# EAGLE schematic galvanika-board-2.0 (EAGLE 9.4.2)
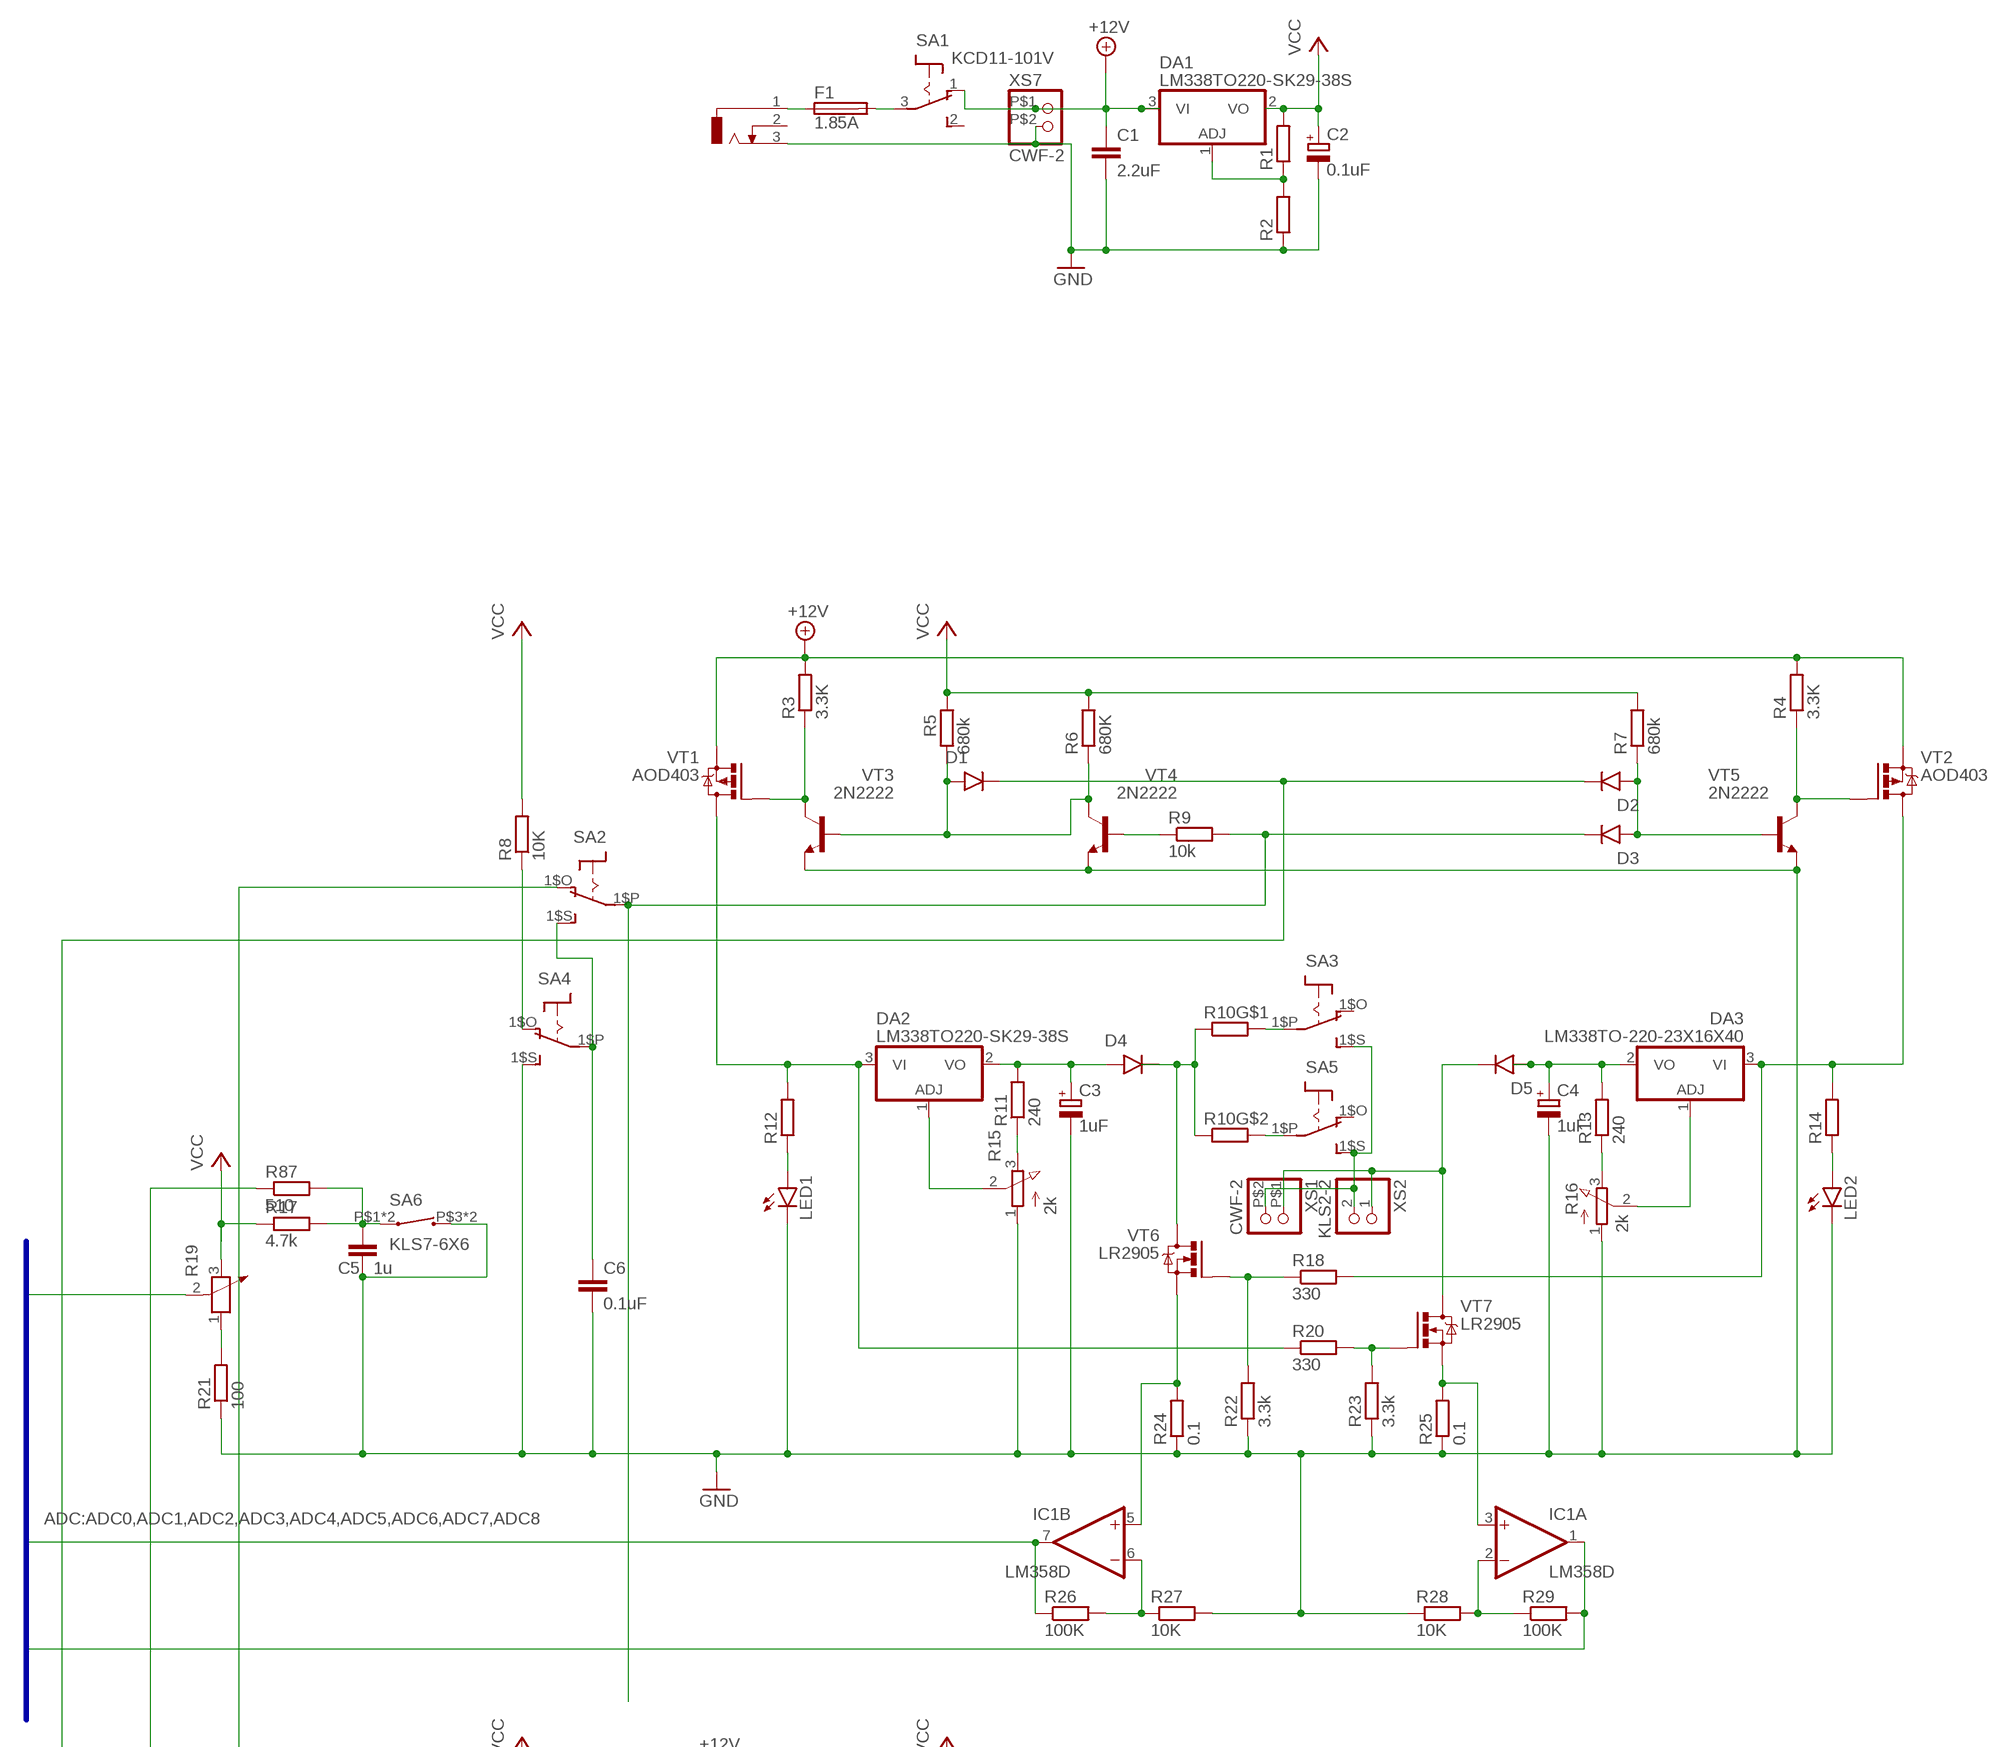
[diagram p0: schematic, sheet 1, part 1 of 2]
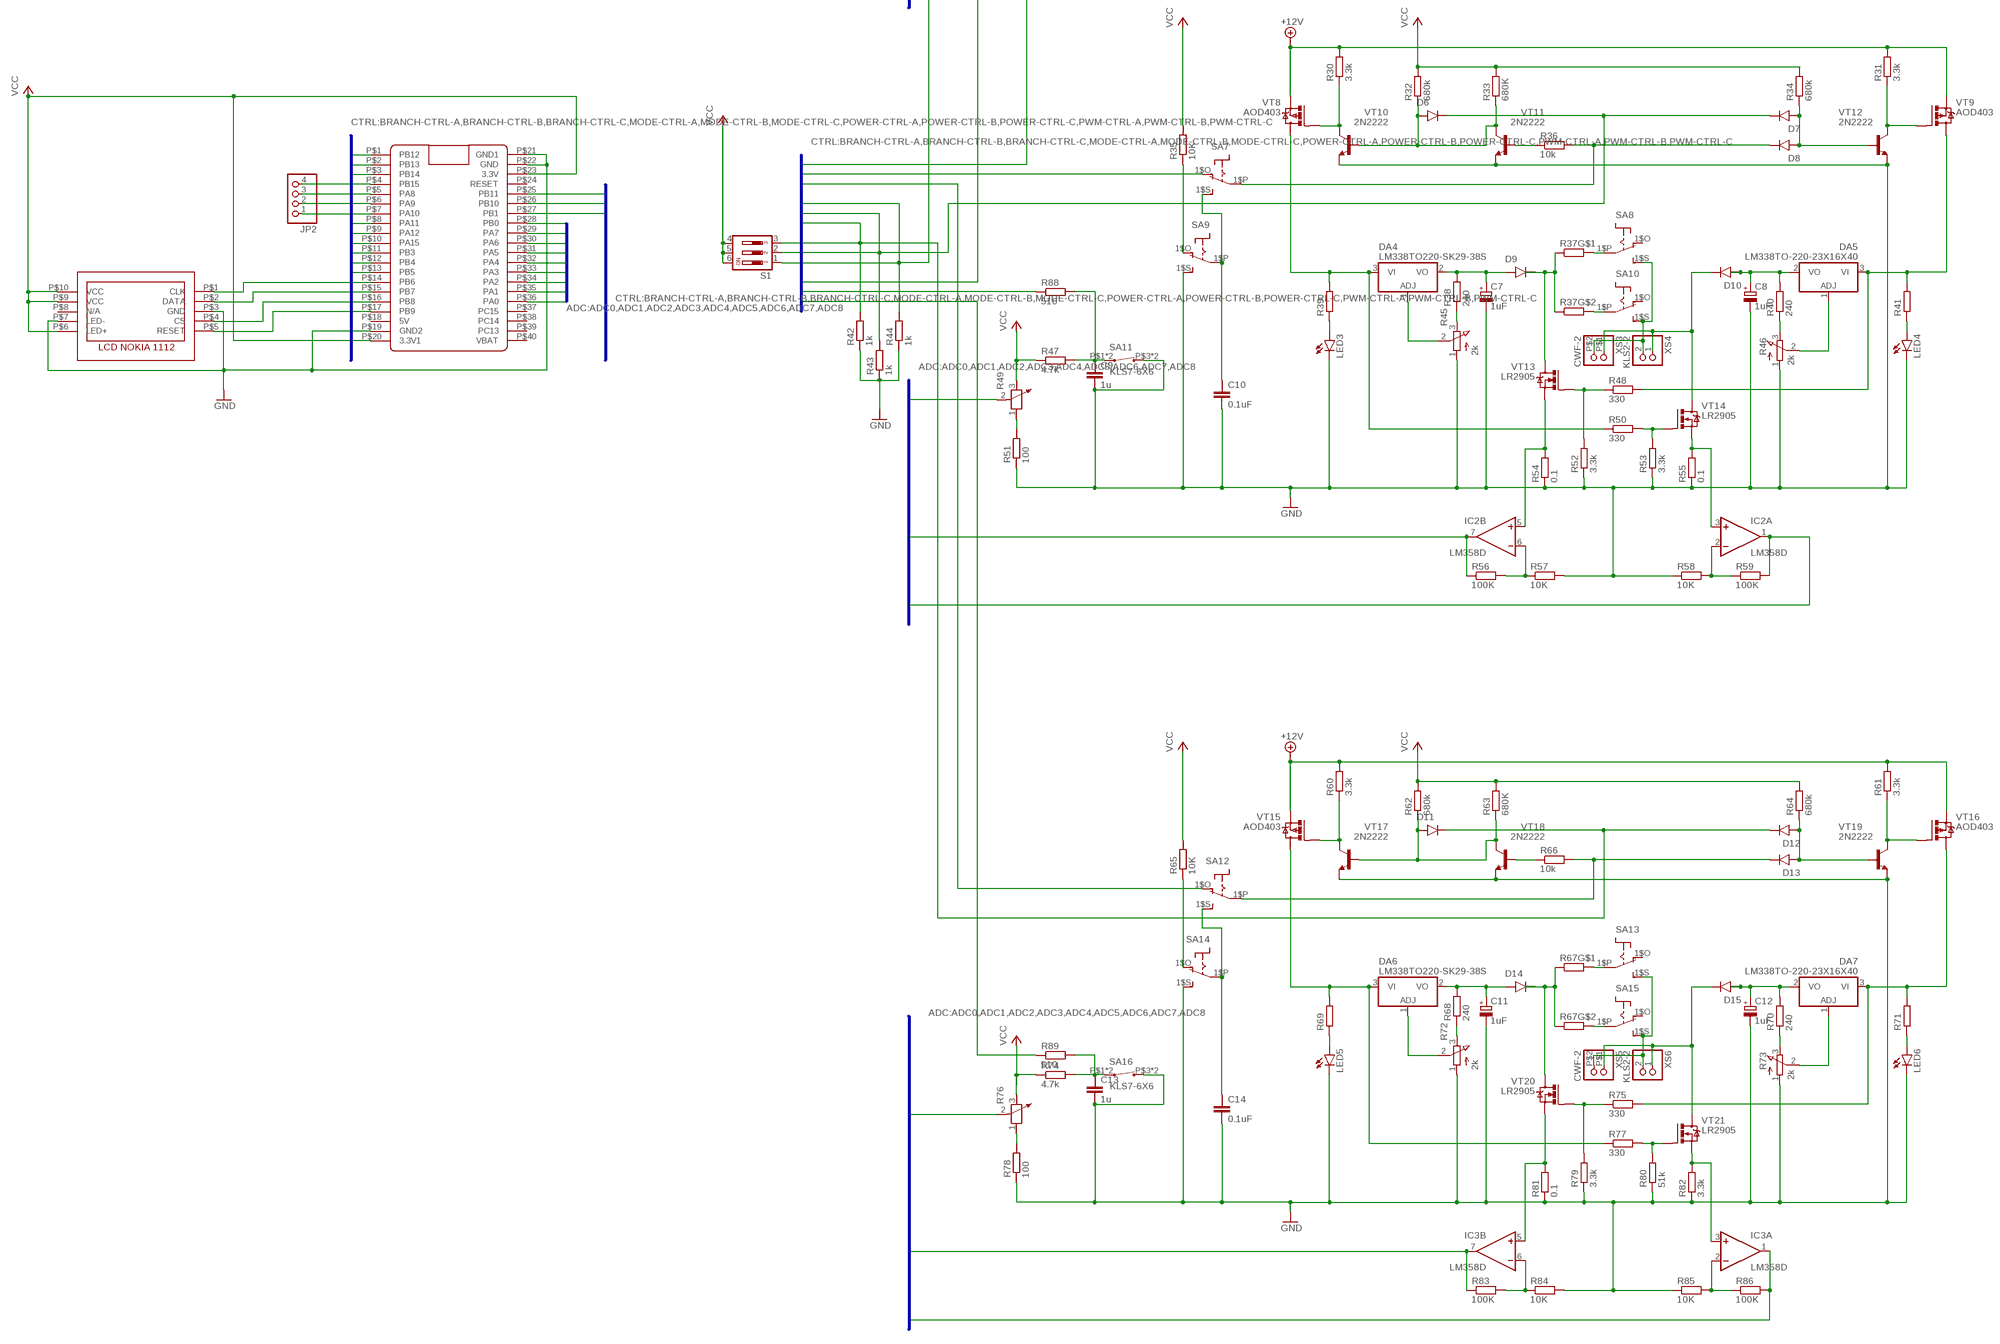
[diagram p1: schematic, sheet 1, part 2 of 2]

## Parts
C1  2.2uF  C-EU025-025X050  [C025-025X050]
C2  0.1uF  CPOL-EUE2.5-5  [E2,5-5]
C3  1uF  CPOL-EUE5-4  [E5-4]
C4  1uF  CPOL-EUE5-4  [E5-4]
C5  1u  C-EUC1206  [C1206]
C6  0.1uF  C-EUC1206  [C1206]
C7  1uF  CPOL-EUE5-4  [E5-4]
C8  1uF  CPOL-EUE5-4  [E5-4]
C9  1u  C-EUC1206  [C1206]
C10  0.1uF  C-EUC1206  [C1206]
C11  1uF  CPOL-EUE5-4  [E5-4]
C12  1uF  CPOL-EUE5-4  [E5-4]
C13  1u  C-EUC1206  [C1206]
C14  0.1uF  C-EUC1206  [C1206]
D1  1N4001  [DO41-10]
D2  1N4001  [DO41-10]
D3  1N4001  [DO41-10]
D4  1N4001  [DO41-10]
D5  1N4001  [DO41-10]
D6  1N4001  [DO41-10]
D7  1N4001  [DO41-10]
D8  1N4001  [DO41-10]
D9  1N4001  [DO41-10]
D10  1N4001  [DO41-10]
D11  1N4001  [DO41-10]
D12  1N4001  [DO41-10]
D13  1N4001  [DO41-10]
D14  1N4001  [DO41-10]
D15  1N4001  [DO41-10]
DA1  LM338TO220-SK29-38S  [TO220-SK29-38S]
DA2  LM338TO220-SK29-38S  [TO220-SK29-38S]
DA3  LM338TO-220-23X16X40  [TO220-23X16X40]
DA4  LM338TO220-SK29-38S  [TO220-SK29-38S]
DA5  LM338TO-220-23X16X40  [TO220-23X16X40]
DA6  LM338TO220-SK29-38S  [TO220-SK29-38S]
DA7  LM338TO-220-23X16X40  [TO220-23X16X40]
DD1  BLUE_PILL  [BLUE_PILL]
F1  1.85A  MF-R  [MF-R]
HG1  WD-G0906WY-BOARD  [WD-G0906WY-BOARD]
IC1  LM358D  [SO08]
IC2  LM358D  [SO08]
IC3  LM358D  [SO08]
J1  DCJ0303  [DCJ0303]
JP2  PINHD-1X4  [1X04]
LED1  LED3MM  [LED3MM]
LED2  LED3MM  [LED3MM]
LED3  LED3MM  [LED3MM]
LED4  LED3MM  [LED3MM]
LED5  LED3MM  [LED3MM]
LED6  LED3MM  [LED3MM]
R1  R-EU_0207/10  [0207/10]
R2  R-EU_0207/10  [0207/10]
R3  3.3K  R-EU_0207/10  [0207/10]
R4  3.3K  R-EU_0207/10  [0207/10]
R5  680k  R-EU_0207/10  [0207/10]
R6  680K  R-EU_0207/10  [0207/10]
R7  680k  R-EU_0207/10  [0207/10]
R8  10K  R-EU_0207/10  [0207/10]
R9  10k  R-EU_0207/10  [0207/10]
R10  SQP-5W-2  [SQP-5W-2]
R11  240  R-EU_0207/10  [0207/10]
R12  R-EU_0207/10  [0207/10]
R13  240  R-EU_0207/10  [0207/10]
R14  R-EU_0207/10  [0207/10]
R15  2k  3RP/1610N  [3RP/1610N]
R16  2k  3RP/1610N  [3RP/1610N]
R17  4.7k  R-EU_R1206  [R1206]
R18  330  R-EU_0207/10  [0207/10]
R19  R0904N  [R0904N]
R20  330  R-EU_0207/10  [0207/10]
R21  100  R-EU_R1206  [R1206]
R22  3.3k  R-EU_0207/10  [0207/10]
R23  3.3k  R-EU_0207/10  [0207/10]
R24  0.1  R-EU_0411/12  [0411/12]
R25  0.1  R-EU_0411/12  [0411/12]
R26  100K  R-EU_R1206  [R1206]
R27  10K  R-EU_R1206  [R1206]
R28  10K  R-EU_R1206  [R1206]
R29  100K  R-EU_R1206  [R1206]
R30  3.3k  R-EU_0207/10  [0207/10]
R31  3.3k  R-EU_0207/10  [0207/10]
R32  680k  R-EU_0207/10  [0207/10]
R33  680K  R-EU_0207/10  [0207/10]
R34  680k  R-EU_0207/10  [0207/10]
R35  10K  R-EU_0207/10  [0207/10]
R36  10k  R-EU_0207/10  [0207/10]
R37  SQP-5W-2  [SQP-5W-2]
R38  240  R-EU_0207/10  [0207/10]
R39  R-EU_0207/10  [0207/10]
R40  240  R-EU_0207/10  [0207/10]
R41  R-EU_0207/10  [0207/10]
R42  1k  R-EU_R1206  [R1206]
R43  1k  R-EU_R1206  [R1206]
R44  1k  R-EU_R1206  [R1206]
R45  2k  3RP/1610N  [3RP/1610N]
R46  2k  3RP/1610N  [3RP/1610N]
R47  4.7k  R-EU_R1206  [R1206]
R48  330  R-EU_0207/10  [0207/10]
R49  R0904N  [R0904N]
R50  330  R-EU_0207/10  [0207/10]
R51  100  R-EU_R1206  [R1206]
R52  3.3k  R-EU_0207/10  [0207/10]
R53  3.3k  R-EU_0207/10  [0207/10]
R54  0.1  R-EU_0411/12  [0411/12]
R55  0.1  R-EU_0411/12  [0411/12]
R56  100K  R-EU_R1206  [R1206]
R57  10K  R-EU_R1206  [R1206]
R58  10K  R-EU_R1206  [R1206]
R59  100K  R-EU_R1206  [R1206]
R60  3.3k  R-EU_0207/10  [0207/10]
R61  3.3k  R-EU_0207/10  [0207/10]
R62  680k  R-EU_0207/10  [0207/10]
R63  680K  R-EU_0207/10  [0207/10]
R64  680k  R-EU_0207/10  [0207/10]
R65  10K  R-EU_0207/10  [0207/10]
R66  10k  R-EU_0207/10  [0207/10]
R67  SQP-5W-2  [SQP-5W-2]
R68  240  R-EU_0207/10  [0207/10]
R69  R-EU_0207/10  [0207/10]
R70  240  R-EU_0207/10  [0207/10]
R71  R-EU_0207/10  [0207/10]
R72  2k  3RP/1610N  [3RP/1610N]
R73  2k  3RP/1610N  [3RP/1610N]
R74  4.7k  R-EU_R1206  [R1206]
R75  330  R-EU_0207/10  [0207/10]
R76  R0904N  [R0904N]
R77  330  R-EU_0207/10  [0207/10]
R78  100  R-EU_R1206  [R1206]
R79  3.3k  R-EU_0207/10  [0207/10]
R80  51k  R-EU_0207/10  [0207/10]
R81  0.1  R-EU_0411/12  [0411/12]
R82  3.3k  R-EU_0411/12  [0411/12]
R83  100K  R-EU_R1206  [R1206]
R84  10K  R-EU_R1206  [R1206]
R85  10K  R-EU_R1206  [R1206]
R86  100K  R-EU_R1206  [R1206]
R87  510  R-EU_R1206  [R1206]
R88  510  R-EU_R1206  [R1206]
R89  510  R-EU_R1206  [R1206]
S1  DS03  [DS-03]
SA1  KCD11-101V  [KCD11-101-V]
SA2  SS12D00DIP  [SS12D00]
SA3  SS12D00DIP  [SS12D00]
SA4  SS12D00DIP  [SS12D00]
SA5  SS12D00DIP  [SS12D00]
SA6  KLS7-6X6  [KLS7-6X6]
SA7  SS12D00DIP  [SS12D00]
SA8  SS12D00DIP  [SS12D00]
SA9  SS12D00DIP  [SS12D00]
SA10  SS12D00DIP  [SS12D00]
SA11  KLS7-6X6  [KLS7-6X6]
SA12  SS12D00DIP  [SS12D00]
SA13  SS12D00DIP  [SS12D00]
SA14  SS12D00DIP  [SS12D00]
SA15  SS12D00DIP  [SS12D00]
SA16  KLS7-6X6  [KLS7-6X6]
VT1  AOD403  [TO252]
VT2  AOD403  [TO252]
VT3  2N2222  [TO92]
VT4  2N2222  [TO92]
VT5  2N2222  [TO92]
VT6  LR2905  [TO252]
VT7  LR2905  [TO252]
VT8  AOD403  [TO252]
VT9  AOD403  [TO252]
VT10  2N2222  [TO92]
VT11  2N2222  [TO92]
VT12  2N2222  [TO92]
VT13  LR2905  [TO252]
VT14  LR2905  [TO252]
VT15  AOD403  [TO252]
VT16  AOD403  [TO252]
VT17  2N2222  [TO92]
VT18  2N2222  [TO92]
VT19  2N2222  [TO92]
VT20  LR2905  [TO252]
VT21  LR2905  [TO252]
XS1  CWF-2  [CWF-2]
XS2  KLS2-2  [KLS2-2]
XS3  CWF-2  [CWF-2]
XS4  KLS2-2  [KLS2-2]
XS5  CWF-2  [CWF-2]
XS6  KLS2-2  [KLS2-2]
XS7  CWF-2  [CWF-2]

## Nets
+12V: C1.1 DA1.3(VI) R3.2 R4.2 R30.2 R31.2 R60.2 R61.2 SA1.1(O) VT1.2(S) VT2.2(S) VT8.2(S) VT9.2(S) VT15.2(S) VT16.2(S) XS7.P$1
A-LEFT: IC1.3(A:+IN) R25.2 VT7.2(S)
A-LEFT1: IC2.3(A:+IN) R55.2 VT14.2(S)
A-LEFT2: IC3.3(A:+IN) R82.2 VT21.2(S)
A-RIGHT: IC1.5(B:+IN) R24.2 VT6.2(S)
A-RIGHT1: IC2.5(B:+IN) R54.2 VT13.2(S)
A-RIGHT2: IC3.5(B:+IN) R81.2 VT20.2(S)
ADC0: DD1.P$36(PA0) R19.2
ADC1: DD1.P$35(PA1) R49.2
ADC2: DD1.P$34(PA2) IC1.7(B:OUT) R26.1
ADC3: DD1.P$33(PA3) IC1.1(A:OUT) R29.2
ADC4: DD1.P$32(PA4) R76.2
ADC5: DD1.P$31(PA5) IC2.1(A:OUT) R59.2
ADC6: DD1.P$30(PA6) IC2.7(B:OUT) R56.1
ADC7: DD1.P$29(PA7) IC3.7(B:OUT) R83.1
ADC8: DD1.P$28(PB0) IC3.1(A:OUT) R86.2
BRANCH-CTRL-A: D3.C(CATHODE) DD1.P$10(PA15) R9.2 SA2.1$P(P)
BRANCH-CTRL-B: D8.C(CATHODE) DD1.P$9(PA12) R36.2 SA7.1$P(P)
BRANCH-CTRL-C: D13.C(CATHODE) DD1.P$8(PA11) R66.2 SA12.1$P(P)
GND: C1.2 C2.- C3.- C4.- C5.2 C6.2 C7.- C8.- C9.2 C10.2 C11.- C12.- C13.2 C14.2 DD1.P$19(GND2) DD1.P$21(GND1) DD1.P$22(GND) HG1.P$3(GND) HG1.P$7(LED-) J1.3 LED1.K(C) LED2.K(C) LED3.K(C) LED4.K(C) LED5.K(C) LED6.K(C) R2.1 R15.1(A) R16.1(A) R21.1 R22.1 R23.1 R24.1 R25.1 R27.2 R28.1 R42.1 R43.1 R44.1 R45.1(A) R46.1(A) R51.1 R52.1 R53.1 R54.1 R55.1 R57.2 R58.1 R72.1(A) R73.1(A) R78.1 R79.1 R80.1 R81.1 R82.1 R84.2 R85.1 SA4.1$S(S) SA6.P$3 SA6.P$4 SA9.1$S(S) SA11.P$3 SA11.P$4 SA14.1$S(S) SA16.P$3 SA16.P$4 VT3.3(E) VT4.3(E) VT5.3(E) VT10.3(E) VT11.3(E) VT12.3(E) VT17.3(E) VT18.3(E) VT19.3(E) XS7.P$2
MODE-CTRL-A: DD1.P$13(PB5) R87.1
MODE-CTRL-B: DD1.P$12(PB4) R88.1
MODE-CTRL-C: DD1.P$11(PB3) R89.1
N$1: R3.1 VT1.1(G) VT3.1(C)
N$2: DD1.P$15(PB7) HG1.P$2(DATA)
N$3: R10.4 SA5.1$P(P)
N$4: DA1.1(ADJ) R1.1 R2.2
N$5: R30.1 VT8.1(G) VT10.1(C)
N$6: R9.1 VT4.2(B)
N$7: D1.A(ANODE) R5.1 R6.1 VT3.2(B) VT4.1(C)
N$8: LED1.A R12.1
N$9: R11.1 R15.3(E)
N$10: DA2.1(ADJ) R15.2(S)
N$11: DD1.P$14(PB6) HG1.P$1(CLK)
N$12: R18.1 R22.2 VT6.1(G)
N$13: D4.C(CATHODE) R10.1 R10.3 VT6.3(D)
N$14: R10.2 SA3.1$P(P)
N$15: R20.2 R23.2 VT7.1(G)
N$16: D2.A(ANODE) D3.A(ANODE) R7.1 VT5.2(B)
N$17: C5.1 R17.2 R87.2 SA6.P$1 SA6.P$2
N$18: R36.1 VT11.2(B)
N$19: LED2.A R14.1
N$20: R4.1 VT2.1(G) VT5.1(C)
N$21: R13.1 R16.3(E)
N$22: LED3.A R39.1
N$23: DA3.1(ADJ) R16.2(S)
N$24: DA4.1(ADJ) R45.2(S)
N$25: D9.C(CATHODE) R37.1 R37.3 VT13.3(D)
N$26: IC1.6(B:-IN) R26.2 R27.1
N$27: IC1.2(A:-IN) R28.2 R29.1
N$28: C9.1 R47.2 R88.2 SA11.P$1 SA11.P$2
N$29: DA5.1(ADJ) R46.2(S)
N$30: LED4.A R41.1
N$31: R31.1 VT9.1(G) VT12.1(C)
N$32: C13.1 R74.2 R89.2 SA16.P$1 SA16.P$2
N$33: IC2.6(B:-IN) R56.2 R57.1
N$34: IC2.2(A:-IN) R58.2 R59.1
N$35: DD1.P$4(PB15) JP2.4
N$36: D10.C(CATHODE) VT14.3(D) XS3.P$1 XS4.1
N$37: R37.4 SA10.1$P(P)
N$38: R37.2 SA8.1$P(P)
N$39: SA8.1$S(S) SA10.1$S(S) XS3.P$2 XS4.2
N$40: R48.1 R52.2 VT13.1(G)
N$41: R50.2 R53.2 VT14.1(G)
N$42: R38.1 R45.3(E)
N$43: R40.1 R46.3(E)
N$44: C10.1 SA7.1$S(S) SA9.1$P(P)
N$45: DD1.P$5(PA8) JP2.3
N$46: D6.A(ANODE) R32.1 R33.1 VT10.2(B) VT11.1(C)
N$47: D7.A(ANODE) D8.A(ANODE) R34.1 VT12.2(B)
N$48: DD1.P$6(PA9) JP2.2
N$49: DD1.P$7(PA10) JP2.1
N$51: R60.1 VT15.1(G) VT17.1(C)
N$53: R66.1 VT18.2(B)
N$54: LED5.A R69.1
N$55: DA6.1(ADJ) R72.2(S)
N$56: D14.C(CATHODE) R67.1 R67.3 VT20.3(D)
N$57: DA7.1(ADJ) R73.2(S)
N$58: LED6.A R71.1
N$59: R61.1 VT16.1(G) VT19.1(C)
N$60: D5.C(CATHODE) VT7.3(D) XS1.P$1 XS2.1
N$62: F1.1 J1.1
N$63: SA3.1$S(S) SA5.1$S(S) XS1.P$2 XS2.2
N$64: IC3.6(B:-IN) R83.2 R84.1
N$65: F1.2 SA1.3(P)
N$66: IC3.2(A:-IN) R85.2 R86.1
N$68: D15.C(CATHODE) VT21.3(D) XS5.P$1 XS6.1
N$69: R67.4 SA15.1$P(P)
N$70: R67.2 SA13.1$P(P)
N$71: SA13.1$S(S) SA15.1$S(S) XS5.P$2 XS6.2
N$72: R75.1 R79.2 VT20.1(G)
N$73: R77.2 R80.2 VT21.1(G)
N$74: R68.1 R72.3(E)
N$75: R70.1 R73.3(E)
N$76: C14.1 SA12.1$S(S) SA14.1$P(P)
N$78: D11.A(ANODE) R62.1 R63.1 VT17.2(B) VT18.1(C)
N$79: D12.A(ANODE) D13.A(ANODE) R64.1 VT19.2(B)
N$84: R19.1 R21.2
N$87: R49.1 R51.2
N$89: C6.1 SA2.1$S(S) SA4.1$P(P)
N$92: R76.1 R78.2
N$95: DD1.P$16(PB8) HG1.P$4(CS)
N$96: DD1.P$17(PB9) HG1.P$5(RESET)
POWER-CTRL-A: D1.C(CATHODE) D2.C(CATHODE) DD1.P$27(PB1) R44.2 S1.1
POWER-CTRL-B: D6.C(CATHODE) D7.C(CATHODE) DD1.P$26(PB10) R43.2 S1.2
POWER-CTRL-C: D11.C(CATHODE) D12.C(CATHODE) DD1.P$25(PB11) R42.2 S1.3
PWM-CTRL-A: DD1.P$2(PB13) SA2.1$O(O)
PWM-CTRL-B: DD1.P$3(PB14) SA7.1$O(O)
PWM-CTRL-C: DD1.P$1(PB12) SA12.1$O(O)
RIGHT-EN: R8.1 SA4.1$O(O)
RIGHT-EN1: R35.1 SA9.1$O(O)
RIGHT-EN2: R65.1 SA14.1$O(O)
VCC: C2.+ DA1.2(VO) DD1.P$20(3.3V1) DD1.P$23(3.3V) HG1.P$6(LED+) HG1.P$9(VCC) HG1.P$10(VCC) R1.2 R5.2 R6.2 R7.2 R8.2 R17.1 R19.3 R32.2 R33.2 R34.2 R35.2 R47.1 R49.3 R62.2 R63.2 R64.2 R65.2 R74.1 R76.3 S1.4 S1.5 S1.6
VI-LEFT: DA2.3(VI) R12.2 R20.1 VT1.3(D)
VI-LEFT1: DA4.3(VI) R39.2 R50.1 VT8.3(D)
VI-LEFT2: DA6.3(VI) R69.2 R77.1 VT15.3(D)
VI-RIGHT: DA3.3(VI) R14.2 R18.2 VT2.3(D)
VI-RIGHT1: DA5.3(VI) R41.2 R48.2 VT9.3(D)
VI-RIGHT2: DA7.3(VI) R71.2 R75.2 VT16.3(D)
VO-LEFT: C3.+ D4.A(ANODE) DA2.2(VO) R11.2
VO-LEFT1: C7.+ D9.A(ANODE) DA4.2(VO) R38.2
VO-LEFT2: C11.+ D14.A(ANODE) DA6.2(VO) R68.2
VO-RIGHT: C4.+ D5.A(ANODE) DA3.2(VO) R13.2
VO-RIGHT1: C8.+ D10.A(ANODE) DA5.2(VO) R40.2
VO-RIGHT2: C12.+ D15.A(ANODE) DA7.2(VO) R70.2
Unconnected: DD1.P$18(5V) DD1.P$24(RESET) DD1.P$37(PC15) DD1.P$38(PC14) DD1.P$39(PC13) DD1.P$40(VBAT) HG1.P$8(N/A) J1.2 SA1.2(S) SA3.1$O(O) SA5.1$O(O) SA8.1$O(O) SA10.1$O(O) SA13.1$O(O) SA15.1$O(O)

## Buses
ADC:ADC0,ADC1,ADC2,ADC3,ADC4,ADC5,ADC6,ADC7,ADC8
CTRL:BRANCH-CTRL-A,BRANCH-CTRL-B,BRANCH-CTRL-C,MODE-CTRL-A,MODE-CTRL-B,MODE-CTRL-C,POWER-CTRL-A,POWER-CTRL-B,POWER-CTRL-C,PWM-CTRL-A,PWM-CTRL-B,PWM-CTRL-C

## Power pins joined to a net without a drawn wire
GND: IC1.4(P:V-) IC2.4(P:V-) IC3.4(P:V-)
VCC: IC1.8(P:V+) IC2.8(P:V+) IC3.8(P:V+)

## Library data of the parts
C1 C5 C6 C9 C10 C13 C14 = rcl:C-EU: CAPACITOR, European symbol; SPICEPREFIX: C
C2-C4 C7 C8 C11 C12 = rcl:CPOL-EU: POLARIZED CAPACITOR, European symbol; SPICEPREFIX: C
D1-D15 = tango:1N4001: DIODE general purpose rectifier, 1 A
DA1-DA7 = dragberry:LM338
DD1 = BluePill:BLUE_PILL
F1 = dragberry:MF-R
HG1 = dragberry:WD-G0906WY-BOARD
IC1-IC3 = linear:LM358: OP AMP also LM158; LM258; LM2904 Source: http://cache.national.com/ds/LM/LM158.pdf
J1 = con-jack:DCJ0303: DC POWER JACK Source: DCJ0303.pdf; OC_FARNELL: unknown; OC_NEWARK: unknown
JP2 = pinhead:PINHD-1X4: PIN HEADER
LED1-LED6 = led:LED: LED OSRAM: - CHIPLED LG R971, LG N971, LY N971, LG Q971, LY Q971, LO R971, LY R971 LH N974, LH R974 LS Q976, LO Q976, LY Q976 LO Q996 - Hyper CHIPLED LW Q18S LB Q993, LB Q99A, LB R99A - SideLED LS A670, LO A670, LY A670, LG A670, LP A670 LB A673, LV A673, LT A673, LW A673 LH A674 LY A675 LS A676, LA A676, LO A676, LY A676, LW A676 LS A679, LY A679, LG A679 - Hyper Micro SIDELED® LS Y876, LA Y876, LO Y876, LY Y876 LT Y87S - SmartLED LW L88C, LW L88S LB L89C, LB L89S, LG L890 LS L89K, LO L89K, LY L89K LS L896, LA L896, LO L896, LY L896 - TOPLED LS T670, LO T670, LY T670, LG T670, LP T670 LSG T670, LSP T670, LSY T670, LOP T670, LYG T670 LG T671, LOG T671, LSG T671 LB T673, LV T673, LT T673, LW T673 LH T674 LS T676, LA T676, LO T676, LY T676, LB T676, LH T676, LSB T676, LW T676 LB T67C, LV T67C, LT T67C, LS T67K, LO T67K, LY T67K, LW E67C LS E67B, LA E67B, LO E67B, LY E67B, LB E67C, LV E67C, LT E67C LW T67C LS T679, LY T679, LG T679 LS T770, LO T770, LY T770, LG T770, LP T770 LB T773, LV T773, LT T773, LW T773 LH T774 LS E675, LA E675, LY E675, LS T675 LS T776, LA T776, LO T776, LY T776, LB T776 LHGB T686 LT T68C, LB T68C - Hyper Mini TOPLED® LB M676 - Mini TOPLED Santana® LG M470 LS M47K, LO M47K, LY M47K Source: http://www.osram.convergy.de LUXEON: - LUMILED® LXK2-PW12-R00, LXK2-PW12-S00, LXK2-PW14-U00, LXK2-PW14-V00 LXK2-PM12-R00, LXK2-PM12-S00, LXK2-PM14-U00 LXK2-PE12-Q00, LXK2-PE12-R00, LXK2-PE12-S00, LXK2-PE14-T00, LXK2-PE14-U00 LXK2-PB12-K00, LXK2-PB12-L00, LXK2-PB12-M00, LXK2-PB14-N00, LXK2-PB14-P00, LXK2-PB14-Q00 LXK2-PR12-L00, LXK2-PR12-M00, LXK2-PR14-Q00, LXK2-PR14-R00 LXK2-PD12-Q00, LXK2-PD12-R00, LXK2-PD12-S00 LXK2-PH12-R00, LXK2-PH12-S00 LXK2-PL12-P00, LXK2-PL12-Q00, LXK2-PL12-R00 Source: www.luxeon.com KINGBRIGHT: KA-3528ASYC Source: www.kingbright.com
R1-R9 R11-R14 R17 R18 R20-R36 R38-R44 R47 R48 R50-R66 R68-R71 R74 R75 R77-R89 = rcl:R-EU_: RESISTOR, European symbol; SPICEPREFIX: R
R10 R37 R67 = dragberry:SQP-5W-2
R15 R16 R45 R46 R72 R73 = pot:3RP/1610N: 16mm Potentiometer one level Source: http://www.alphapotentiometers.net/html/16mm_pot_2.html
R19 R49 R76 = dragberry:R0904N
S1 = switch-dil:DS03: DIL/CODE SWITCH; OC_FARNELL: 1255223; OC_NEWARK: unknown
SA1 = dragberry:KCD11-101
SA2-SA5 SA7-SA10 SA12-SA15 = dragberry:SS12D00
SA6 SA11 SA16 = dragberry:KLS7-6X6
VT1 VT2 VT8 VT9 VT15 VT16 = dragberry:AOD403
VT3-VT5 VT10-VT12 VT17-VT19 = dragberry:2N2222
VT6 VT7 VT13 VT14 VT20 VT21 = dragberry:LR2905
XS1 XS3 XS5 XS7 = dragberry:CWF-2
XS2 XS4 XS6 = dragberry:KLS2-2